# EAGLE board flycopter_v1 (EAGLE 9.6.2), part 1 of 2
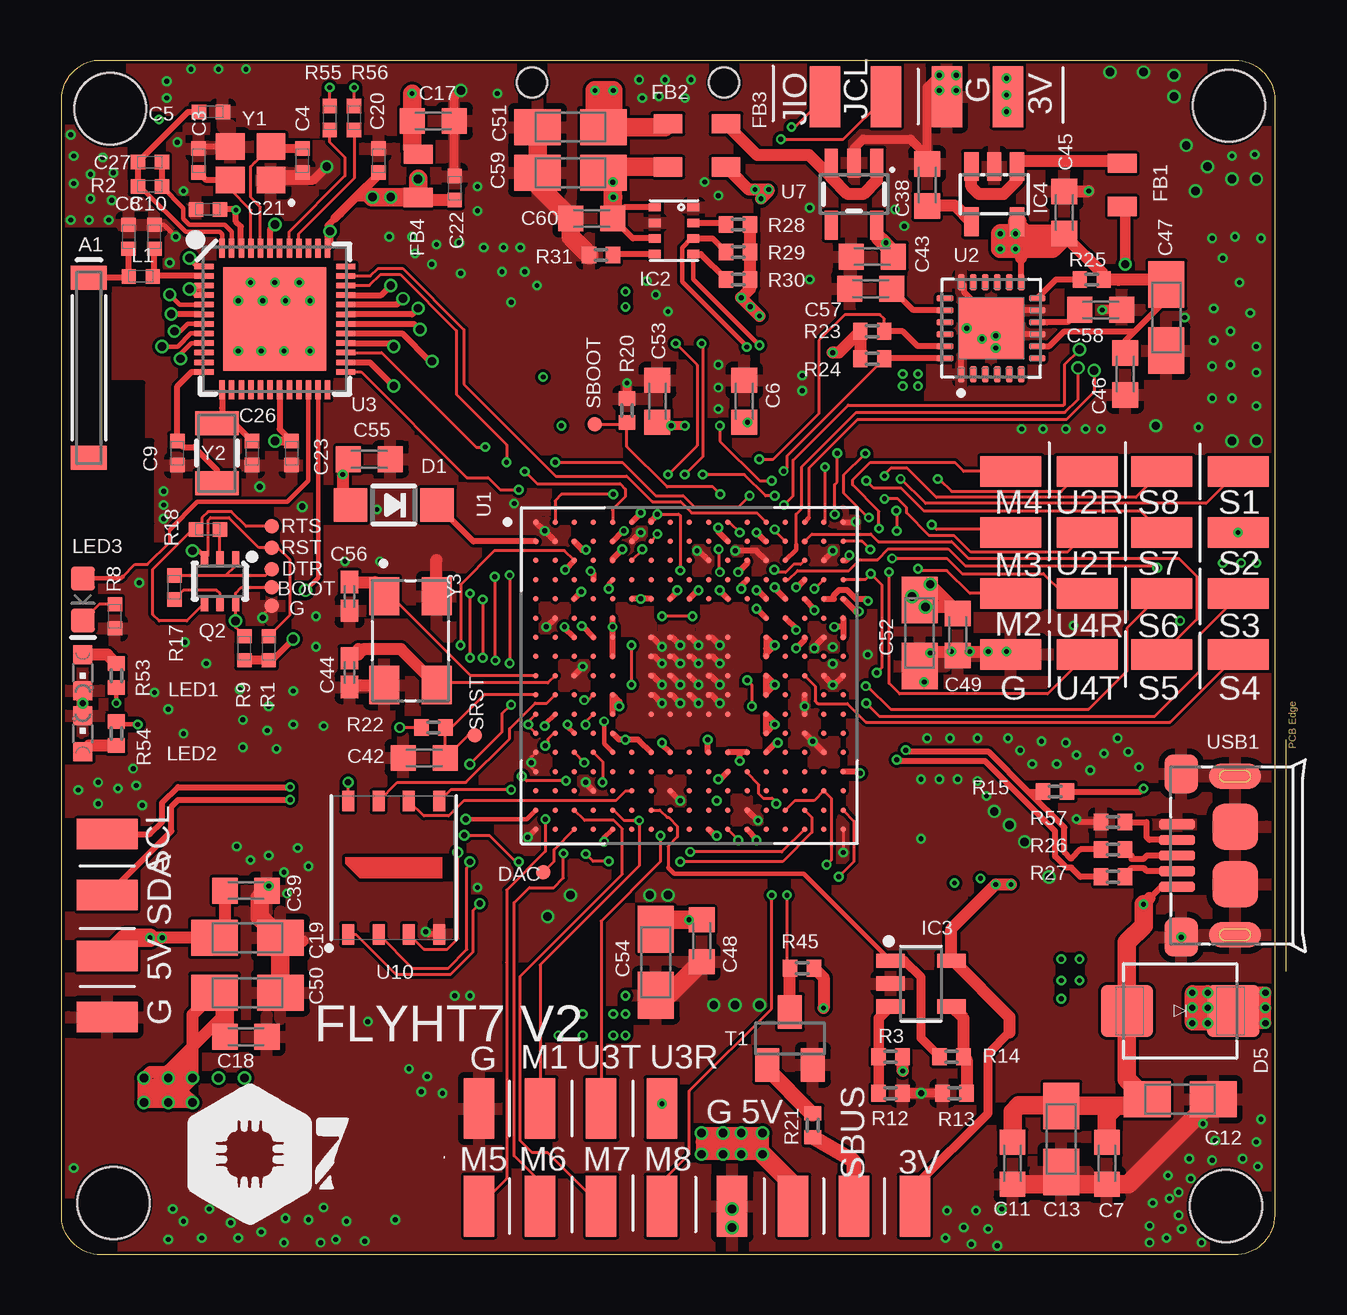
[diagram p8: board, top side]
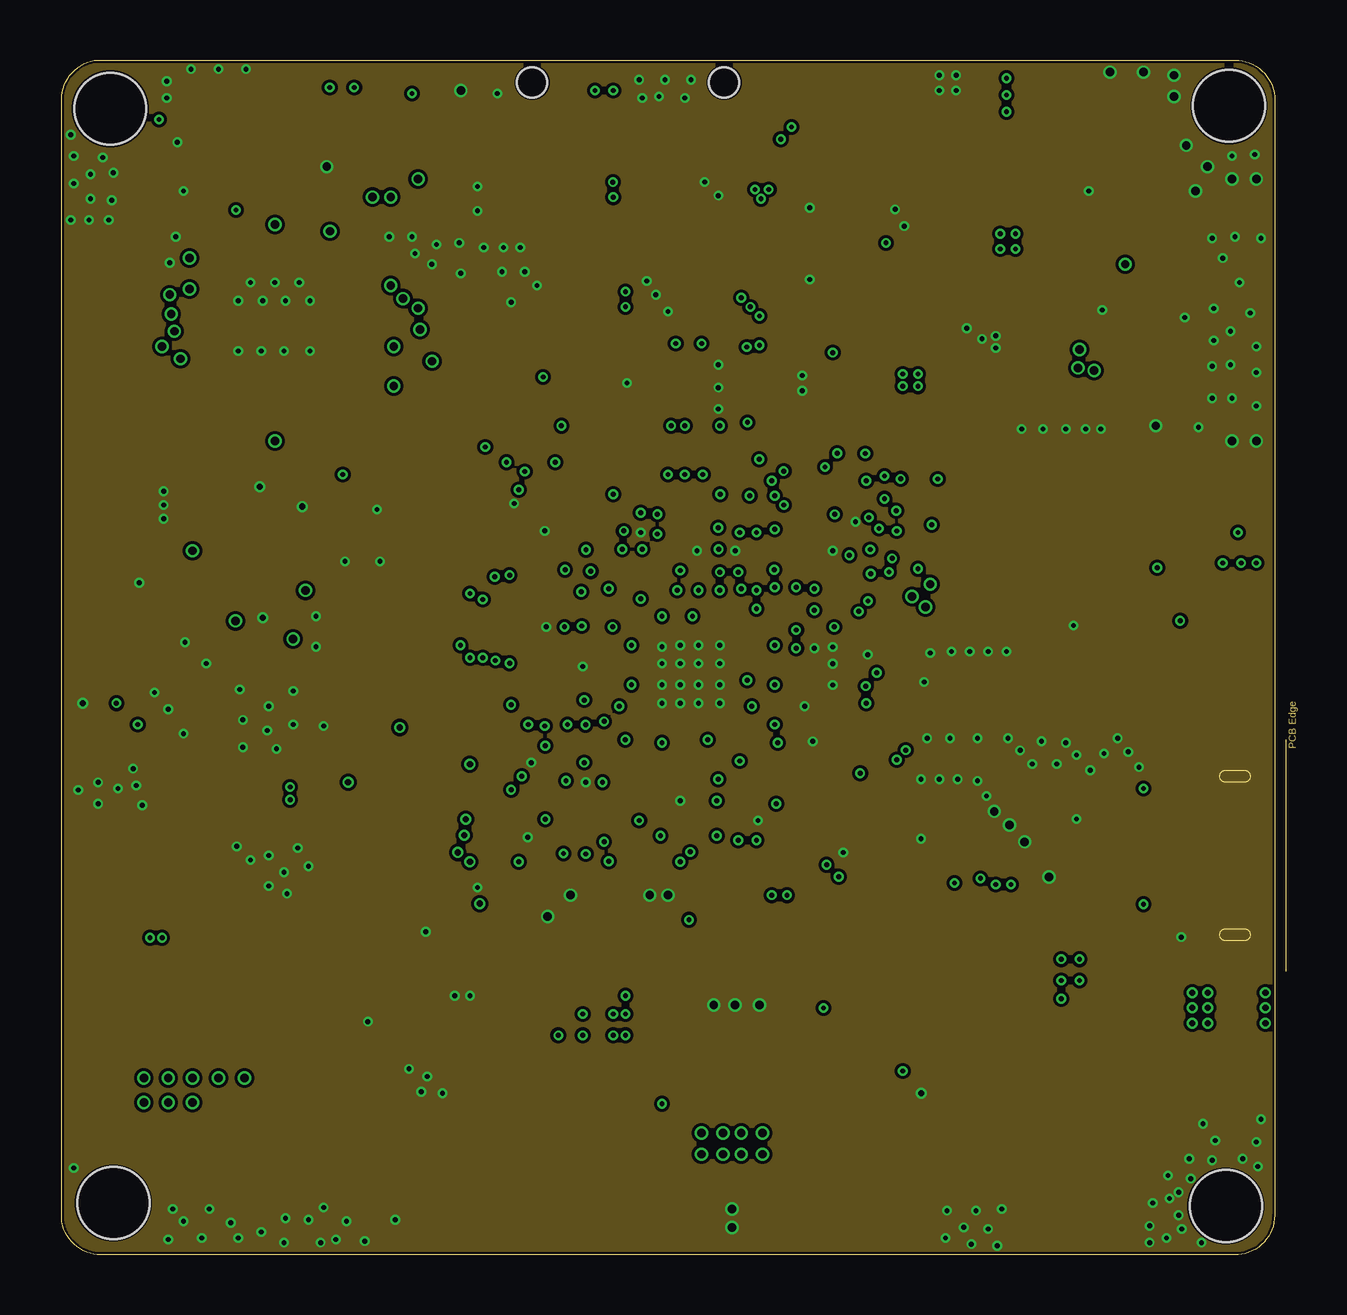
[diagram p9: board, inner layer Ground]
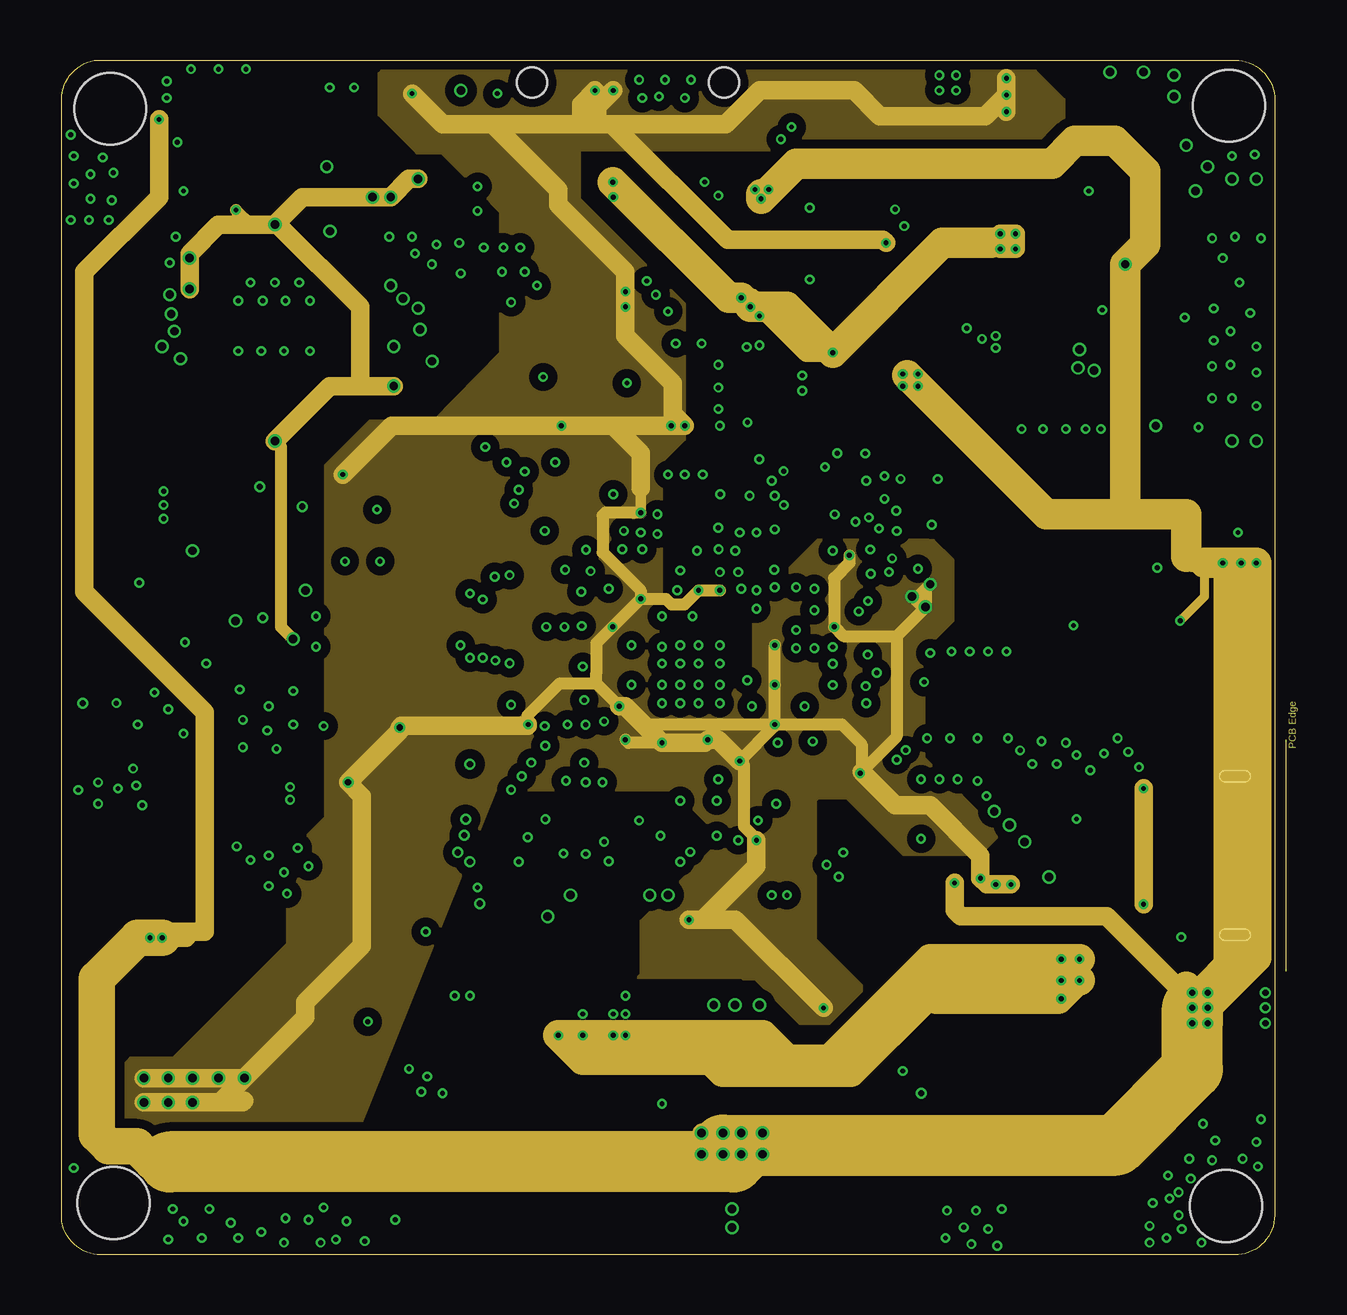
[diagram p10: board, inner layer Power]
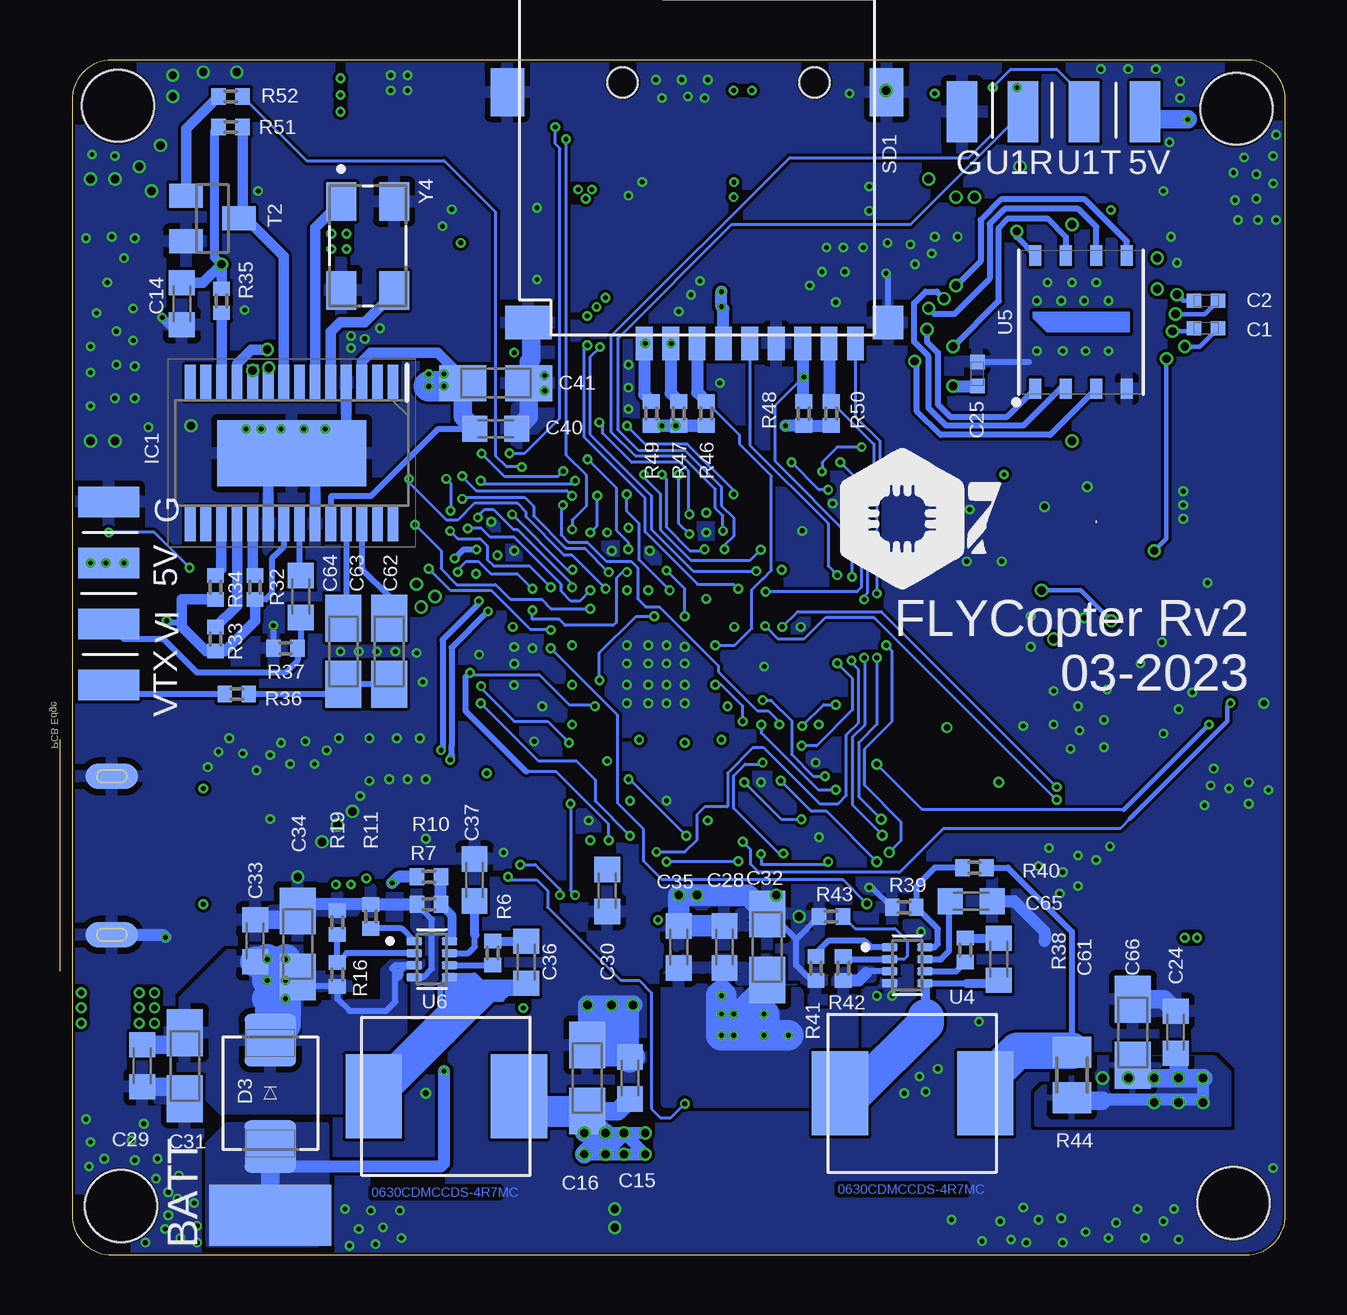
[diagram p11: board, bottom side, seen from below]

Size 50.55 x 49.78 mm. Coordinates in mm from the lower left corner, seen from the top.
Outline: 0,1.52 0,48.13 arc-86 1.52,49.78 48.9,49.78 arc-86 50.55,48.26 50.55,1.65 arc-86 49.02,0 1.65,0 arc-86 0,1.52
Copper layers (1*2*15*16): Top 0.035559375mm / dielectric 0.17018125mm / Ground 0.01778125mm / dielectric 47mil / Power 0.01778125mm / dielectric 0.17018125mm / Bottom 0.035559375mm
Design rules "jlcpcb-4-layer": minimum track width 5mil, minimum drill 0.2mm, track to track 0.126490625mm, track to pad 0.126490625mm, pad to pad 0.126490625mm, via to via 0.126490625mm, smd to smd 0mil, copper to edge 0.1mm, drill to drill 5mil, minimum pad ring 4mil, minimum via ring 4mil, stop-mask expansion 3mil, vias tented up to drill 100mil, thermal gap 10mil
Holes 3 mm at 2.03,47.75 2.16,2.16 48.64,47.88 48.51,2.03
tRestrict: area 0.1,33.9 to 2,40.1; area 2,33.9 to 3.4,36.3; area 2,30.5 to 3.7,33.9; area 0.1,30.5 to 2,32.6; area 0.1,29.2 to 3.7,30.5; area 0.1,41.3 to 2.2,42.7

## Footprints (pad centres in the part's own frame; a part is rotated, then mirrored left to right if it is on the bottom)
ANT-2.4GHZ-8.0X1.0MM = smd 1 x 1.5: FEED -3.75,0; NC 3.75,0
SMD2,54-5,08 = smd 2.54 x 5.08: 1 0,0
TP06R = smd 0.6 x 0.6: TP 0,0
0402-TIGHT = smd 0.6 x 0.6: 1 -0.5,0; 2 0.5,0
C0603K = smd 1.05 x 1.08: 1 -0.875,0; 2 0.875,0
A/3216-18R = smd 1.95 x 1.5: + 1.375,0; - -1.375,0
C0402K = smd 0.925 x 0.74: 1 -0.6,0; 2 0.6,0
1X4-SMT = smd 1.27 x 2.54: 1 -3.81,0; 2 -1.27,0; 3 1.27,0; 4 3.81,0
DIODE_SOD123 = smd 1.4 x 1.4: A 1.805,0; C -1.805,0
SMB = smd 2.17 x 2.14: A 2.215,0; C -2.215,0
0805 = smd 0.8 x 1.2: 1 -0.9,0; 2 0.9,0
SOP65P640X120-29N = smd 1.475 x 0.45: 1 -2.938,4.225; 2 -2.938,3.575; 3 -2.938,2.925; 4 -2.938,2.275; 5 -2.938,1.625; 6 -2.938,0.975; 7 -2.938,0.325; 8 -2.938,-0.325; 9 -2.938,-0.975; 10 -2.938,-1.625; 11 -2.938,-2.275; 12 -2.938,-2.925; 13 -2.938,-3.575; 14 -2.938,-4.225; 15 2.938,-4.225; 16 2.938,-3.575; 17 2.938,-2.925; 18 2.938,-2.275; 19 2.938,-1.625; 20 2.938,-0.975; 21 2.938,-0.325; 22 2.938,0.325; 23 2.938,0.975; 24 2.938,1.625; 25 2.938,2.275; 26 2.938,2.925; 27 2.938,3.575; 28 2.938,4.225 | smd 2.75 x 6.2: 29 0,0
BMP280 = smd 0.5 x 0.35: 1 0.8,0.975; 2 0.8,0.325; 3 0.8,-0.325; 4 0.8,-0.975; 5 -0.8,-0.975; 6 -0.8,-0.325; 7 -0.8,0.325; 8 -0.8,0.975
SOT95P280X145-5N = smd 1.186 x 0.597: 1 -1.264,0.95; 2 -1.264,0; 3 -1.264,-0.95; 4 1.264,-0.95; 5 1.264,0.95
TSOT23-5L = smd 0.6 x 1.2: 1 -0.95,-1.15; 2 0,-1.15; 3 0.95,-1.15; 4 0.95,1.15; 5 -0.95,1.15
CHIPLED_0603 = smd 0.8 x 0.8: A 0,-0.75; C 0,0.75
LED-0603 = smd 1 x 1: A -0.877,0; C 0.877,0
SC70-6 = smd 0.3 x 0.66: 1 -0.65,-0.92; 2 0,-0.92; 3 0.65,-0.92; 4 0.65,0.92; 5 0,0.92; 6 -0.65,0.92
R0402 = smd 0.6 x 0.7: 1 -0.5,0; 2 0.5,0
M0805 = smd 1.3 x 1.6: 1 -0.95,0; 2 0.95,0
TF-PULL = smd 0.7 x 1.4: 1 -2.2,-7.62; 2 -1.1,-7.62; 3 0,-7.62; 4 1.1,-7.62; 5 2.2,-7.62; 6 3.3,-7.62; 7 4.4,-7.62; 8 5.5,-7.62; 9 6.6,-7.62 | smd 1.4 x 2: S1 -7.9,2.85; S2 7.9,2.85 | smd 1.28 x 1.4: S3 7.96,-6.75 | smd 1.95 x 1.4: S4 -7.025,-6.75 | hole 1.25: -3.1,3.25; 4.9,3.25
SOT23-BEC = smd 1 x 1.4: B -0.95,-1.1; C 0,1.1; E 0.95,-1.1
IC_STM32H750XBH6 = smd 0.225 x 0.225: A1 -6.4,6.4; A2 -5.6,6.4; A3 -4.8,6.4; A4 -4,6.4; A5 -3.2,6.4; A6 -2.4,6.4; A7 -1.6,6.4; A8 -0.8,6.4; A9 0,6.4; A10 0.8,6.4; A11 1.6,6.4; A12 2.4,6.4; A13 3.2,6.4; A14 4,6.4; A15 4.8,6.4; A16 5.6,6.4; A17 6.4,6.4; B1 -6.4,5.6; B2 -5.6,5.6; B3 -4.8,5.6; B4 -4,5.6; B5 -3.2,5.6; B6 -2.4,5.6; B7 -1.6,5.6; B8 -0.8,5.6; B9 0,5.6; B10 0.8,5.6; B11 1.6,5.6; B12 2.4,5.6; B13 3.2,5.6; B14 4,5.6; B15 4.8,5.6; B16 5.6,5.6; B17 6.4,5.6; C1 -6.4,4.8; C2 -5.6,4.8; C3 -4.8,4.8; C4 -4,4.8; C5 -3.2,4.8; C6 -2.4,4.8; C7 -1.6,4.8; C8 -0.8,4.8; C9 0,4.8; C10 0.8,4.8; C11 1.6,4.8; C12 2.4,4.8; C13 3.2,4.8; C14 4,4.8; C15 4.8,4.8; C16 5.6,4.8; C17 6.4,4.8; D1 -6.4,4; D2 -5.6,4; D3 -4.8,4; D4 -4,4; D5 -3.2,4; D6 -2.4,4; D7 -1.6,4; D8 -0.8,4; D9 0,4; D10 0.8,4; D11 1.6,4; D12 2.4,4; D13 3.2,4; D14 4,4; D15 4.8,4; D16 5.6,4; D17 6.4,4; E1 -6.4,3.2; E2 -5.6,3.2; E3 -4.8,3.2; E4 -4,3.2; E5 -3.2,3.2; E6 -2.4,3.2; E7 -1.6,3.2; E8 -0.8,3.2; E9 0,3.2; E10 0.8,3.2; E11 1.6,3.2; E12 2.4,3.2; E13 3.2,3.2; E14 4,3.2; E15 4.8,3.2; E16 5.6,3.2; E17 6.4,3.2; F1 -6.4,2.4; F2 -5.6,2.4; F3 -4.8,2.4; F4 -4,2.4; F5 -3.2,2.4; F13 3.2,2.4; F14 4,2.4; F15 4.8,2.4; F16 5.6,2.4; F17 6.4,2.4; G1 -6.4,1.6; G2 -5.6,1.6; G3 -4.8,1.6; G4 -4,1.6; G5 -3.2,1.6; G7 -1.6,1.6; G8 -0.8,1.6; G9 0,1.6; G10 0.8,1.6; G11 1.6,1.6; G13 3.2,1.6; G14 4,1.6; G15 4.8,1.6; G16 5.6,1.6; G17 6.4,1.6; H1 -6.4,0.8; H2 -5.6,0.8; H3 -4.8,0.8; H4 -4,0.8; H5 -3.2,0.8; H7 -1.6,0.8; H8 -0.8,0.8; H9 0,0.8; H10 0.8,0.8; H11 1.6,0.8; H13 3.2,0.8; H14 4,0.8; H15 4.8,0.8; H16 5.6,0.8; H17 6.4,0.8; J1 -6.4,0; J2 -5.6,0; J3 -4.8,0; J4 -4,0; J5 -3.2,0; J7 -1.6,0; J8 -0.8,0; J9 0,0; J10 0.8,0; J11 1.6,0; J13 3.2,0; J14 4,0; J15 4.8,0; J16 5.6,0; J17 6.4,0; K1 -6.4,-0.8; K2 -5.6,-0.8; K3 -4.8,-0.8; K4 -4,-0.8; K5 -3.2,-0.8; K7 -1.6,-0.8; K8 -0.8,-0.8; K9 0,-0.8; K10 0.8,-0.8; K11 1.6,-0.8; K13 3.2,-0.8; K14 4,-0.8; K15 4.8,-0.8; K16 5.6,-0.8; K17 6.4,-0.8; L1 -6.4,-1.6; L2 -5.6,-1.6; L3 -4.8,-1.6; L4 -4,-1.6; L5 -3.2,-1.6; L7 -1.6,-1.6; L8 -0.8,-1.6; L9 0,-1.6; L10 0.8,-1.6; L11 1.6,-1.6; L13 3.2,-1.6; L14 4,-1.6; L15 4.8,-1.6; L16 5.6,-1.6; L17 6.4,-1.6; M1 -6.4,-2.4; M2 -5.6,-2.4; M3 -4.8,-2.4; M4 -4,-2.4; M5 -3.2,-2.4; M13 3.2,-2.4; M14 4,-2.4; M15 4.8,-2.4; M16 5.6,-2.4; M17 6.4,-2.4; N1 -6.4,-3.2; N2 -5.6,-3.2; N3 -4.8,-3.2; N4 -4,-3.2; N5 -3.2,-3.2; N6 -2.4,-3.2; N7 -1.6,-3.2; N8 -0.8,-3.2; N9 0,-3.2; N10 0.8,-3.2; N11 1.6,-3.2; N12 2.4,-3.2; N13 3.2,-3.2; N14 4,-3.2; N15 4.8,-3.2; N16 5.6,-3.2; N17 6.4,-3.2; P1 -6.4,-4; P2 -5.6,-4; P3 -4.8,-4; P4 -4,-4; P5 -3.2,-4; P6 -2.4,-4; P7 -1.6,-4; P8 -0.8,-4; P9 0,-4; P10 0.8,-4; P11 1.6,-4; P12 2.4,-4; P13 3.2,-4; P14 4,-4; P15 4.8,-4; P16 5.6,-4; P17 6.4,-4; R1 -6.4,-4.8; R2 -5.6,-4.8; R3 -4.8,-4.8; R4 -4,-4.8; R5 -3.2,-4.8; R6 -2.4,-4.8; R7 -1.6,-4.8; R8 -0.8,-4.8; R9 0,-4.8; R10 0.8,-4.8; R11 1.6,-4.8; R12 2.4,-4.8; R13 3.2,-4.8; R14 4,-4.8; R15 4.8,-4.8; R16 5.6,-4.8; R17 6.4,-4.8; T1 -6.4,-5.6; T2 -5.6,-5.6; T3 -4.8,-5.6; T4 -4,-5.6; T5 -3.2,-5.6; T6 -2.4,-5.6; T7 -1.6,-5.6; T8 -0.8,-5.6; T9 0,-5.6; T10 0.8,-5.6; T11 1.6,-5.6; T12 2.4,-5.6; T13 3.2,-5.6; T14 4,-5.6; T15 4.8,-5.6; T16 5.6,-5.6; T17 6.4,-5.6; U1 -6.4,-6.4; U2 -5.6,-6.4; U3 -4.8,-6.4; U4 -4,-6.4; U5 -3.2,-6.4; U6 -2.4,-6.4; U7 -1.6,-6.4; U8 -0.8,-6.4; U9 0,-6.4; U10 0.8,-6.4; U11 1.6,-6.4; U12 2.4,-6.4; U13 3.2,-6.4; U14 4,-6.4; U15 4.8,-6.4; U16 5.6,-6.4; U17 6.4,-6.4
24-VFQFN = smd 0.26 x 0.69: 1 -1.25,-1.92; 2 -0.75,-1.92; 3 -0.25,-1.92; 4 0.25,-1.92; 5 0.75,-1.92; 6 1.25,-1.92; 13 1.25,1.92; 14 0.75,1.92; 15 0.25,1.92; 16 -0.25,1.92; 17 -0.75,1.92; 18 -1.25,1.92 | smd 0.69 x 0.26: 7 1.92,-1.25; 8 1.92,-0.75; 9 1.92,-0.25; 10 1.92,0.25; 11 1.92,0.75; 12 1.92,1.25; 19 -1.92,1.25; 20 -1.92,0.75; 21 -1.92,0.25; 22 -1.92,-0.25; 23 -1.92,-0.75; 24 -1.92,-1.25 | smd 2.7 x 2.6: 25 0,0
QFN48-0.4MM = smd 0.8 x 0.23: 1 -2.95,2.2; 2 -2.95,1.8; 3 -2.95,1.4; 4 -2.95,1; 5 -2.95,0.6; 6 -2.95,0.2; 7 -2.95,-0.2; 8 -2.95,-0.6; 9 -2.95,-1; 10 -2.95,-1.4; 11 -2.95,-1.8; 12 -2.95,-2.2; 25 2.95,-2.2; 26 2.95,-1.8; 27 2.95,-1.4; 28 2.95,-1; 29 2.95,-0.6; 30 2.95,-0.2; 31 2.95,0.2; 32 2.95,0.6; 33 2.95,1; 34 2.95,1.4; 35 2.95,1.8; 36 2.95,2.2 | smd 0.23 x 0.8: 13 -2.2,-2.95; 14 -1.8,-2.95; 15 -1.4,-2.95; 16 -1,-2.95; 17 -0.6,-2.95; 18 -0.2,-2.95; 19 0.2,-2.95; 20 0.6,-2.95; 21 1,-2.95; 22 1.4,-2.95; 23 1.8,-2.95; 24 2.2,-2.95; 37 2.2,2.95; 38 1.8,2.95; 39 1.4,2.95; 40 1,2.95; 41 0.6,2.95; 42 0.2,2.95; 43 -0.2,2.95; 44 -0.6,2.95; 45 -1,2.95; 46 -1.4,2.95; 47 -1.8,2.95; 48 -2.2,2.95 | smd 4.3 x 4.3: EP 0,0
SOFL50P160X60-8N = smd 0.66 x 0.32: 1 -0.735,0.75; 2 -0.735,0.25; 3 -0.735,-0.25; 4 -0.735,-0.75; 5 0.735,-0.75; 6 0.735,-0.25; 7 0.735,0.25; 8 0.735,0.75
WSON-8-6X5-SKINNY_CENTERPAD = smd 0.85 x 0.5: 1 -2.775,1.905; 2 -2.775,0.635; 3 -2.775,-0.635; 4 -2.775,-1.905; 5 2.775,-1.905; 6 2.775,-0.635; 7 2.775,0.635; 8 2.775,1.905
SOT23-5 = smd 0.55 x 1.2: 1 -0.95,-1.3; 2 0,-1.3; 3 0.95,-1.3; 4 0.95,1.3; 5 -0.95,1.3
0630CDMCCDS-4R7MC = smd 2.35 x 3.5: P$1 6.55,3.3; P$2 0.5,3.3
MICRO-USB5+6P-SMD-0.65-B = smd 0.4 x 1.5: 1 -1.3,-0.25; 2 -0.65,-0.25; 3 0,-0.25; 4 0.65,-0.25; 5 1.3,-0.25 | smd 1.6 x 1.4: S1 -3.4,-0.427; S6 3.4,-0.427 | smd 1.067 x 2.184 bottom: S2B -3.302,-2.667; S5B 3.302,-2.667 | smd 1.067 x 2.184: S2T -3.302,-2.667; S5T 3.302,-2.667 | smd 1.9 x 1.9: S3 -1.2,-2.675; S4 1.2,-2.675
CRYSTAL-SMD-2X2.5MM = smd 1.2 x 1.1: P1 0.846,0.69; P2 -0.854,0.69; P3 -0.854,-0.71; P4 0.846,-0.71
CRYSTAL-SMD-3.2X1.5MM = smd 1 x 1.8: P$1 -1.25,0; P$2 1.25,0
XTAL_ECS-240-12-30BQ-AEN-TR = smd 1.6 x 1.25: 1 -1.85,-1.1; 2 1.85,-1.1; 3 1.85,1.1; 4 -1.85,1.1

## Placement (x,y rotation side)
A1  [ANT-2.4GHZ-8.0X1.0MM]  1.14,36.96 270 top
BATT  [SMD2,54-5,08]  42.29,1.65 90 bottom
BOOT  TPTP06R  [TP06R]  8.76,27.81 180 top
C1  270pF  [0402-TIGHT]  3.3,39.75 180 bottom
C2  270pF  [0402-TIGHT]  3.3,38.61 0 bottom
C3  12pF  [0402-TIGHT]  5.71,45.59 270 top
C4  12pF  [0402-TIGHT]  10.03,45.59 90 top
C5  10nF  [0402-TIGHT]  6.22,47.62 180 top
C6  2.2uF  [C0603K]  28.45,35.56 90 top
C7  100nF  [C0603K]  43.56,3.81 270 top
C8  DNP  [0402-TIGHT]  2.79,42.42 90 top
C9  15pF  [0402-TIGHT]  4.83,33.4 90 top
C10  DNP  [0402-TIGHT]  3.87,42.42 90 top
C11  100nF  [C0603K]  39.62,3.81 270 top
C12  47uF  [A/3216-18R]  46.61,6.48 180 top
C13  47uF  [A/3216-18R]  41.66,4.83 90 top
C14  100nF  [C0603K]  45.97,39.62 270 bottom
C15  100nF  [C0603K]  27.3,7.37 90 bottom
C16  47uF  [A/3216-18R]  29.08,7.37 270 bottom
C17  100nF  [C0603K]  15.49,47.24 0 top
C18  100nF  [C0603K]  7.68,9.08 0 top
C19  47uF  [A/3216-18R]  7.75,13.21 180 top
C20  0.1uF  [0402-TIGHT]  13.21,45.59 90 top
C21  0.1uF  [0402-TIGHT]  6.1,43.56 180 top
C22  10uF  [0402-TIGHT]  16.38,44.45 90 top
C23  0.1uF  [0402-TIGHT]  9.59,33.4 270 top
C24  100nF  [C0603K]  4.57,9.27 90 bottom
C25  0.1uF  [0402-TIGHT]  12.83,36.7 90 bottom
C26  15pF  [0402-TIGHT]  7.94,33.4 90 top
C27  3.0nF  [0402-TIGHT]  3.68,45.53 0 top
C28  100nF  [C0603K]  23.37,12.83 90 bottom
C29  100nF  [C0603K]  47.62,7.87 270 bottom
C30  2.2uF  [C0603K]  28.26,15.18 270 bottom
C31  47uF  [A/3216-18R]  45.85,7.87 90 bottom
C32  47uF  [A/3216-18R]  21.59,12.83 270 bottom
C33  100nF  [C0603K]  42.93,13.08 90 bottom
C34  47uF  [A/3216-18R]  41.15,12.95 270 bottom
C35  100nF  [C0603K]  25.27,12.83 90 bottom
C36  100nF  [C0603K]  31.62,12.19 270 bottom
C37  33nF  [C0603K]  33.78,15.62 90 bottom
C38  10nF  [C0603K]  36.07,44.58 90 top
C39  100nF  [C0603K]  7.68,15.18 0 top
C40  100nF  [C0603K]  32.89,34.42 0 bottom
C41  47uF  [A/3216-18R]  32.89,36.32 180 bottom
C42  100nF  [C0603K]  15.11,20.7 0 top
C43  100nF  [C0603K]  33.78,41.59 180 top
C44  22pF  [C0402K]  12,24.26 90 top
C45  100nF  [C0603K]  41.78,43.43 90 top
C46  100nF  [C0603K]  44.32,36.7 270 top
C47  47uF  [A/3216-18R]  46.04,39.05 90 top
C48  100nF  [C0603K]  26.67,13.08 270 top
C49  100nF  [C0603K]  37.34,25.84 270 top
C50  47uF  [A/3216-18R]  7.75,10.92 180 top
C51  47uF  [A/3216-18R]  21.21,46.99 0 top
C52  47uF  [A/3216-18R]  35.75,25.91 90 top
C53  100nF  [C0603K]  24.83,35.56 90 top
C54  47uF  [A/3216-18R]  24.77,12.19 90 top
C55  100nF  [C0603K]  12.83,33.15 0 top
C56  22pF  [C0402K]  12,27.43 90 top
C57  100nF  [C0603K]  33.72,40.26 0 top
C58  100nF  [C0603K]  43.31,39.37 0 top
C59  47uF  [A/3216-18R]  21.21,45.09 0 top
C60  100nF  [C0603K]  22.1,43.18 180 top
C61  100nF  [C0603K]  11.94,12.32 270 bottom
C62  100uF  [A/3216-18R]  37.34,25.15 90 bottom
C63  22uF  [A/3216-18R]  39.24,25.15 90 bottom
C64  100nF  [C0603K]  41.02,27.43 270 bottom
C65  33nF  [C0603K]  13.08,14.73 0 bottom
C66  47uF  [A/3216-18R]  6.35,9.27 270 bottom
CN1  1X4SMT  [1X4-SMT]  39.56,28.83 90 top
CN2  1X4SMT  [1X4-SMT]  21.21,2.03 0 top
CN3  1X4SMT  [1X4-SMT]  49.02,28.83 270 top
CN4  1X4SMT  [1X4-SMT]  45.85,28.83 90 top
CN5  1X4SMT  [1X4-SMT]  9.65,47.62 180 bottom
CN6  1X4SMT  [1X4-SMT]  49.02,27.56 270 bottom
CN7  1X4SMT  [1X4-SMT]  21.21,6.1 0 top
CN8  1X4SMT  [1X4-SMT]  42.74,28.83 90 top
CN9  1X4SMT  [1X4-SMT]  31.75,2.03 0 top
CN10  1X4SMT  [1X4-SMT]  35.62,48.26 0 top
CN11  1X4SMT  [1X4-SMT]  1.91,13.72 90 top
D1  BAS16J  [DIODE_SOD123]  13.84,31.24 180 top
D3  SS54B  [SMB]  42.29,6.73 270 bottom
D5  SS54B  [SMB]  46.61,10.16 180 top
DAC  TPTP06R  [TP06R]  20.07,15.94 0 top
DTR  TPTP06R  [TP06R]  8.76,28.57 180 top
FB1  600Ω  [0805]  44.2,44.58 90 top
FB2  600Ω  [0805]  25.27,46.23 270 top
FB3  600Ω  [0805]  27.69,46.23 90 top
FB4  600Ω  [0805]  14.86,44.96 270 top
G  TPTP06R  [TP06R]  8.76,27.05 0 top
IC1  AT7456E  [SOP65P640X120-29N]  41.4,33.4 270 bottom
IC2  BMP280  [BMP280]  25.53,42.67 0 top
IC3  MCP6001T_SOT23  [SOT95P280X145-5N]  35.81,11.3 0 top
IC4  LD398518RG  [TSOT23-5L]  38.86,44.2 180 top
L1  0  [0402-TIGHT]  3.3,40.77 0 top
LED1  blue  [CHIPLED_0603]  0.89,24.26 180 top
LED2  green  [CHIPLED_0603]  0.89,21.72 0 top
LED3  BLUE  [LED-0603]  0.89,27.3 270 top
Q2  MBT3904DW1T1  [SC70-6]  6.6,28.07 180 top
R1  10k  [0402-TIGHT]  8.64,25.27 270 top
R2  20k  [0402-TIGHT]  3.68,44.51 180 top
R3  270k  [R0402]  34.54,8.26 0 top
R6  0  [R0402]  33.02,12.57 90 bottom
R7  10k  [R0402]  35.69,14.61 0 bottom
R8  1k  [0402-TIGHT]  2.22,26.61 90 top
R9  10k  [0402-TIGHT]  7.62,25.27 270 top
R10  100k  [R0402]  35.69,15.75 0 bottom
R11  0  [R0402]  38.1,14.1 270 bottom
R12  27k  [R0402]  34.54,6.73 180 top
R13  1M  [R0402]  37.21,6.73 0 top
R14  0  [R0402]  37.08,8.26 180 top
R15  4.7k  [R0402]  41.4,19.3 180 top
R16  270k  [R0402]  39.5,11.68 270 bottom
R17  10k  [0402-TIGHT]  4.7,27.81 270 top
R18  10k  [0402-TIGHT]  6.1,30.23 0 top
R19  50k  [R0402]  39.5,13.84 270 bottom
R20  100k  [R0402]  23.56,35.18 90 top
R21  1k  [R0402]  31.31,5.4 270 top
R22  100k  [R0402]  15.49,21.97 0 top
R23  2.2k  [R0402]  33.78,38.48 0 top
R24  2.2k  [R0402]  33.78,37.34 0 top
R25  2.2k  [R0402]  42.93,40.64 0 top
R26  22  [R0402]  43.81,16.89 180 top
R27  22  [R0402]  43.81,15.75 180 top
R28  2.2k  [R0402]  28.19,42.93 180 top
R29  2.2k  [R0402]  28.19,41.78 180 top
R30  2.2k  [R0402]  28.19,40.64 180 top
R31  2.2k  [R0402]  22.48,41.66 0 top
R32  10k  [R0402]  42.93,27.81 270 bottom
R33  10k  [R0402]  44.58,25.65 270 bottom
R34  10k  [R0402]  44.58,27.81 270 bottom
R35  10k  [R0402]  44.32,39.75 270 bottom
R36  75  [R0402]  43.69,23.37 180 bottom
R37  75  [R0402]  41.66,25.27 0 bottom
R38  0  [R0402]  13.34,12.7 90 bottom
R39  10k  [R0402]  15.88,14.48 0 bottom
R40  80k  [R0402]  12.95,16.13 180 bottom
R41  0  [R0402]  19.56,11.94 90 bottom
R42  270k  [R0402]  18.41,11.94 270 bottom
R43  50k  [R0402]  18.92,14.1 0 bottom
R44  0  [M0805]  8.89,7.49 270 bottom
R45  10k  [R0402]  30.86,11.94 180 top
R46  10k  [R0402]  24.13,35.05 90 bottom
R47  10k  [R0402]  25.27,35.05 90 bottom
R48  10k  [R0402]  20.07,35.05 90 bottom
R49  10k  [R0402]  26.42,35.05 90 bottom
R50  10k  [R0402]  18.92,35.05 90 bottom
R51  10k  [R0402]  43.94,46.99 180 bottom
R52  2.2k  [R0402]  43.94,48.26 0 bottom
R53  330  [R0402]  2.29,24.13 270 top
R54  330  [R0402]  2.29,21.72 90 top
R55  0  [0402-TIGHT]  11.18,47.37 270 top
R56  0  [0402-TIGHT]  12.19,47.37 270 top
R57  5.11k  [R0402]  43.81,18.03 180 top
RST  TPTP06R  [TP06R]  8.76,29.46 180 top
RTS  TPTP06R  [TP06R]  8.76,30.35 180 top
SBOOT  TPTP06R  [TP06R]  22.23,34.61 0 top
SD1  TF-HOLDER  [TF-PULL]  24.51,45.59 0 bottom
SRST  TPTP06R  [TP06R]  17.21,21.65 0 top
T1  BC817C  [SOT23-BEC]  30.35,9.02 0 top
T2  BC817C  [SOT23-BEC]  44.7,43.18 270 bottom
U1  STM32H750XBH6  [IC_STM32H750XBH6]  26.16,24.13 0 top
U2  MPU-6050  [24-VFQFN]  38.73,38.61 0 top
U3  ESP32  [QFN48-0.4MM]  8.89,38.99 0 top
U4  TPS62933PDRLR  [SOFL50P160X60-8N]  15.75,12.06 0 bottom
U5  W25QXX128MBIT-6X5-SKINNY_CENTER  [WSON-8-6X5-SKINNY_CENTERPAD]  8.51,38.86 90 bottom
U6  TPS62933PDRLR  [SOFL50P160X60-8N]  35.56,12.32 0 bottom
U7  3.3V  [SOT23-5]  33.02,44.2 180 top
U10  W25QXX128MBIT-6X5-SKINNY_CENTER  [WSON-8-6X5-SKINNY_CENTERPAD]  13.84,16.13 90 top
U$1  [OZK_20]  18.54,27.75 0 bottom
U$2  [OZK_20]  5.27,1.27 0 top
U$5  6.8uH  [0630CDMCCDS-4R7MC]  38.48,3.3 0 bottom
U$9  4.7uH  [0630CDMCCDS-4R7MC]  19.05,3.43 0 bottom
USB1  10118193-0001LF  [MICRO-USB5+6P-SMD-0.65-B]  46.23,16.64 90 top
Y1  40MHz  [CRYSTAL-SMD-2X2.5MM]  7.87,45.47 180 top
Y2  32.768kHz  [CRYSTAL-SMD-3.2X1.5MM]  6.48,33.4 90 top
Y3  ECS-240-12-30BQ-AEN-TR  [XTAL_ECS-240-12-30BQ-AEN-TR]  14.54,25.59 270 top
Y4  ECS-240-12-30BQ-AEN-TR  [XTAL_ECS-240-12-30BQ-AEN-TR]  38.23,42.04 270 bottom